# Altium schematic sheet Sallen.SchDoc
size A
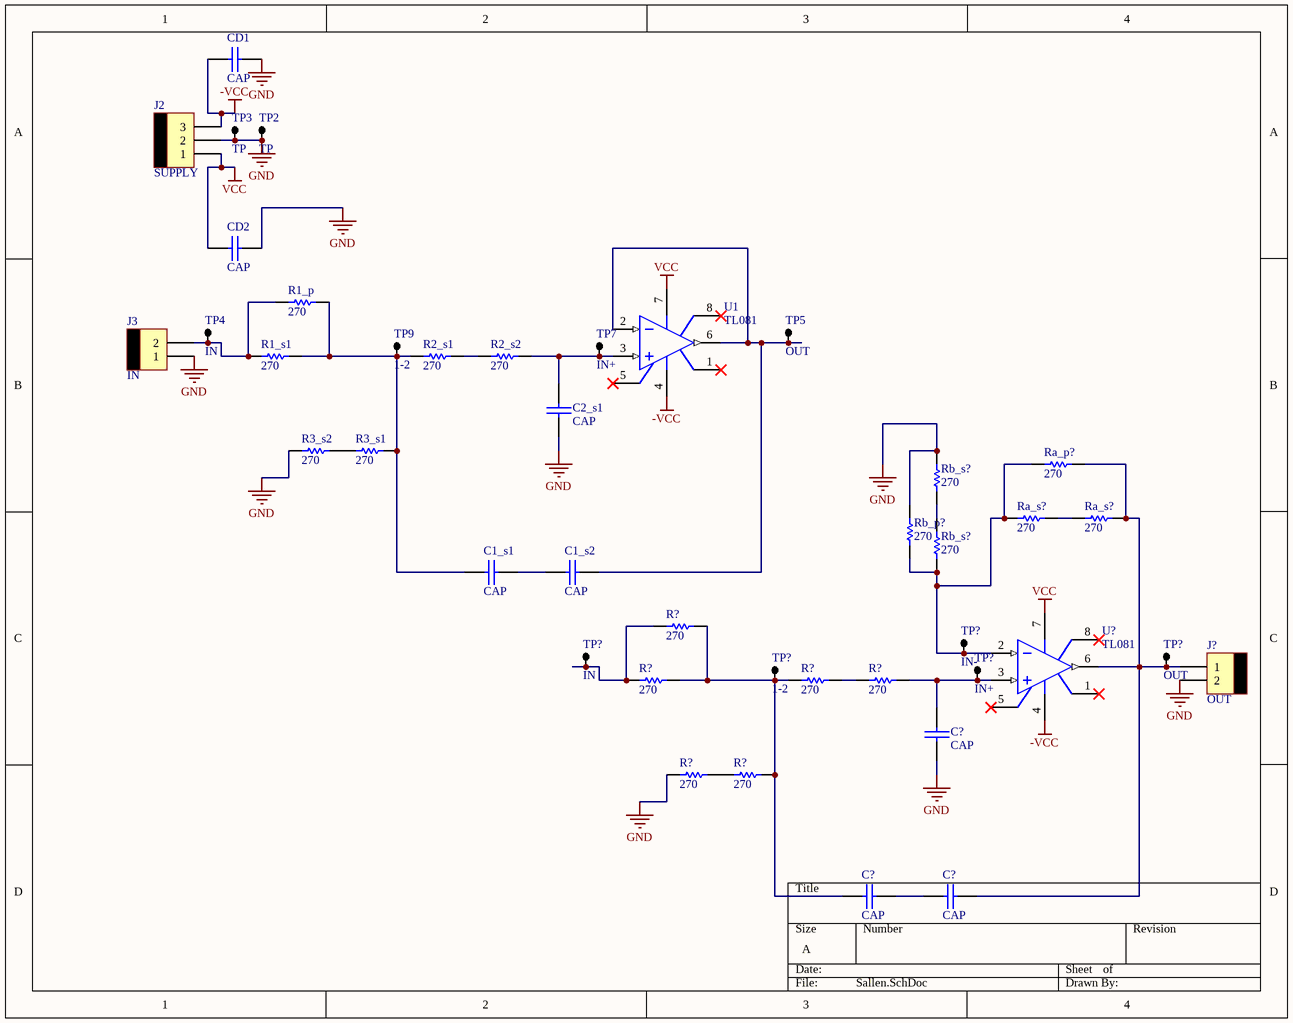
[diagram p0: Sallen.SchDoc]

## Parts
(Parts that share a designator on the sheet are numbered #1, #2 ... from top to bottom, then left to right.)
C1_s1  CAP  [0805]
C1_s2  CAP  [0805]
C2_s1  CAP  [0805]
C?#1  CAP  [0805]
C?#2  CAP  [0805]
C?#3  CAP  [0805]
CD1  CAP  [0805]
CD2  CAP  [0805]
J2  SUPPLY  [MOLEX3]
J3  IN  [MOLEX2]
J?  OUT  [MOLEX2]
R1_p  270  [0805]
R1_s1  270  [0805]
R2_s1  270  [0805]
R2_s2  270  [0805]
R3_s1  270  [0805]
R3_s2  270  [0805]
R?#1  270  [0805]
R?#2  270  [0805]
R?#3  270  [0805]
R?#4  270  [0805]
R?#5  270  [0805]
R?#6  270  [0805]
Ra_p?  270  [0805]
Ra_s?#1  270  [0805]
Ra_s?#2  270  [0805]
Rb_p?  270  [0805]
Rb_s?#1  270  [0805]
Rb_s?#2  270  [0805]
TP2  TP  [TPTH]
TP3  TP  [TPTH]
TP4  IN  [TPTH]
TP5  OUT  [TPTH]
TP7  IN+  [TPTH]
TP9  1-2  [TPTH]
TP?#1  IN-  [TPTH]
TP?#2  IN  [TPTH]
TP?#3  OUT  [TPTH]
TP?#4  1-2  [TPTH]
TP?#5  IN+  [TPTH]
U1  TL081  [P008]
U?  TL081  [P008]

## Nets
-VCC: CD1.1 J2.3 U1.4(V-) U?.4(V-)
GND: C2_s1.2 C?#1.2 CD1.2 CD2.2 J2.2 J3.1 J?.2 R3_s2.1 R?#5.1 Rb_p?.1 Rb_s?#1.1 TP2.1 TP3.1
VCC: CD2.1 J2.1 U1.7(V+) U?.7(V+)
NetC1_s1_1: C1_s1.1 R1_p.1 R1_s1.1 R2_s1.2 R3_s1.2 TP9.1
NetC1_s1_2: C1_s1.2 C1_s2.1
NetC1_s2_2: C1_s2.2 TP5.1 U1.2(IN-) U1.6(OUT)
NetC2_s1_1: C2_s1.1 R2_s2.2 TP7.1 U1.3(IN+)
NetC?#1_1: C?#1.1 R?#4.2 TP?#5.1 U?.3(IN+)
NetC?#2_1: C?#2.1 R?#1.1 R?#2.1 R?#3.2 R?#6.2 TP?#4.1
NetC?#2_2: C?#2.2 C?#3.1
NetC?#3_2: C?#3.2 J?.1 Ra_p?.1 Ra_s?#2.2 TP?#3.1 U?.6(OUT)
NetJ3_2: J3.2 R1_p.2 R1_s1.2 TP4.1
NetR2_s1_1: R2_s1.1 R2_s2.1
NetR3_s1_1: R3_s1.1 R3_s2.2
NetR?#1_2: R?#1.2 R?#2.2 TP?#2.1
NetR?#3_1: R?#3.1 R?#4.1
NetR?#5_2: R?#5.2 R?#6.1
NetRa_p?_2: Ra_p?.2 Ra_s?#1.2 Rb_p?.2 Rb_s?#2.2 TP?#1.1 U?.2(IN-)
NetRa_s?#1_1: Ra_s?#1.1 Ra_s?#2.1
NetRb_s?#1_2: Rb_s?#1.2 Rb_s?#2.1

Not connected (* = marked no-connect by the designer): U1 1(OS_TRIM)* 5(OS_TRIM)* 8(NC)*; U? 1(OS_TRIM)* 5(OS_TRIM)* 8(NC)*

## Library data of the parts
J2 = MOLEX3
J3 J? = MOLEX2
R1_p R1_s1 R2_s1 R2_s2 R3_s1 R3_s2 R?#1-R?#6 Ra_p? Ra_s?#1 Ra_s?#2 Rb_p? Rb_s?#1 Rb_s?#2 = RES
TP4 TP5 TP7 TP9 TP?#1-TP?#5 = TP
U1 U? = TL081P: JFET-Input Operational Amplifier; Note: Pin 8 is not connected; Published: 16-Jan-2001; LatestRevisionDate: 04-Mar-2005; LatestRevisionNote: Stylized 3D Model Added.; DatasheetVersion: Feb-1999; PackageVersion: Jun-1999; PackageReference: P008; Publisher: Altium Limited; PackageDescription: DIP; 8 Leads; Row Spacing 7.62 mm; Pitch 2.54 mm; Code_JEDEC: MO-001-AN; ComponentLink1Description: Manufacturer Link; ComponentLink1URL: http://www.ti.com/; ComponentLink2Description: Datasheet; ComponentLink2URL: http://www-s.ti.com/sc/ds/tl081.pdf